# Altium project MultiSheetPractice.PrjPcb
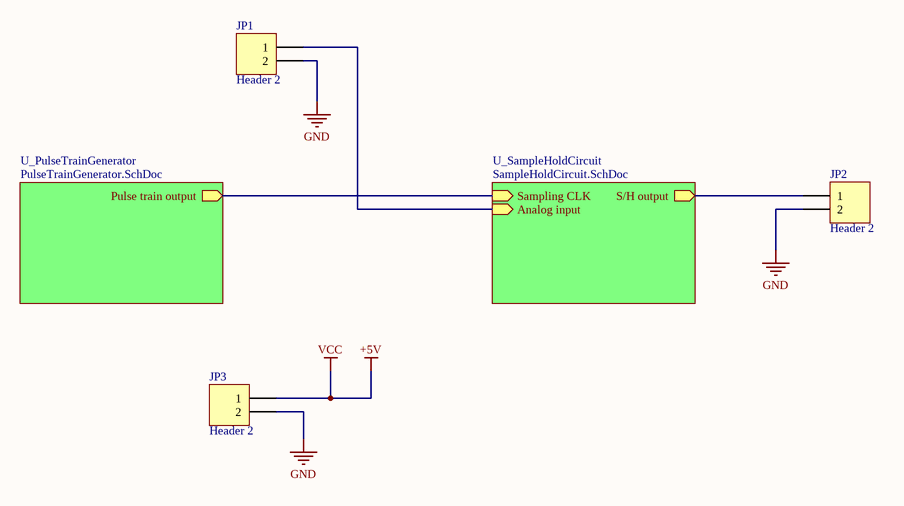
[diagram p0: Top.SchDoc]
3 sheets, 13 parts. Net scope: hierarchical (ports join the sheet entries above them; power ports are global).
Sheets:
  Top.SchDoc
    U_SampleHoldCircuit = SampleHoldCircuit.SchDoc
    U_PulseTrainGenerator = PulseTrainGenerator.SchDoc

## Sheet Top.SchDoc
size A4; SheetNumber: 1; SheetTotal: 3

### Parts
JP1  Header 2  [HDR1X2]
JP2  Header 2  [HDR1X2]
JP3  Header 2  [HDR1X2]

### Sub-sheets
U_PulseTrainGenerator = PulseTrainGenerator.SchDoc: Pulse train output (out)
U_SampleHoldCircuit = SampleHoldCircuit.SchDoc: Sampling CLK (in), Analog input (in), S/H output (out)

### Nets
+5V: JP3.1  [also labelled VCC]
GND: JP1.2 JP2.2 JP3.2
NetJP1_1: JP1.1 ; sheet U_SampleHoldCircuit/Analog input
NetJP2_1: JP2.1 ; sheet U_SampleHoldCircuit/S/H output
NetU2_2: sheet U_SampleHoldCircuit/Sampling CLK, sheet U_PulseTrainGenerator/Pulse train output

### Library data of the parts
JP1-JP3 = Header 2: Header, 2-Pin; Revision: 17-Jul-2002: Re-released for DXP Platform.; Publisher: Altium Limited

## Sheet SampleHoldCircuit.SchDoc
size A4; SheetNumber: 3; SheetTotal: 3
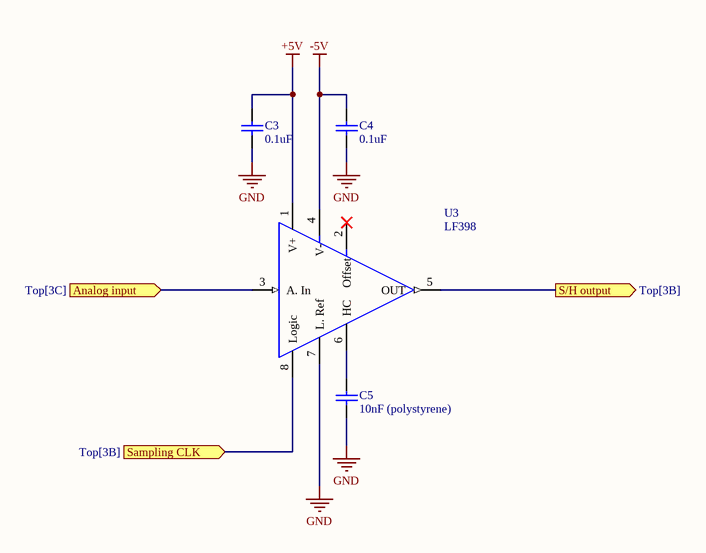
[diagram p1: SampleHoldCircuit.SchDoc]

### Parts
C3  0.1uF
C4  0.1uF
C5  10nF (polystyrene)
U3  LF398

### Ports
Analog input (in, see Top[3C]), S/H output (out, see Top[3B]), Sampling CLK (in, see Top[3B])

### Nets
+5V: C3.2 U3.1(V+)
-5V: C4.2 U3.4(V-)
GND: C3.1 C4.1 C5.1 U3.7(L._Ref)
NetC5_2: C5.2 U3.6(HC)
NetJP1_1: U3.3(A._In) ; port Analog input
NetJP2_1: U3.5(OUT) ; port S/H output
NetU2_2: U3.8(Logic) ; port Sampling CLK

Not connected (* = marked no-connect by the designer): U3 2(Offset)*

### Library data of the parts
C3-C5 = Cap: Ceramic Capacitor; Value: 100pF; Published: 8-Jun-2000; LatestRevisionDate: 17-Jul-2002; LatestRevisionNote: Re-released for DXP Platform.; PackageReference: RAD-0.3; Publisher: Altium Limited; PackageDescription: Radial Cap, Thru-Hole; 2 Leads; 0.3 in Pin Spacing
U3 = LF398: Sample and Hold

## Sheet PulseTrainGenerator.SchDoc
size A4; SheetNumber: 2; SheetTotal: 3
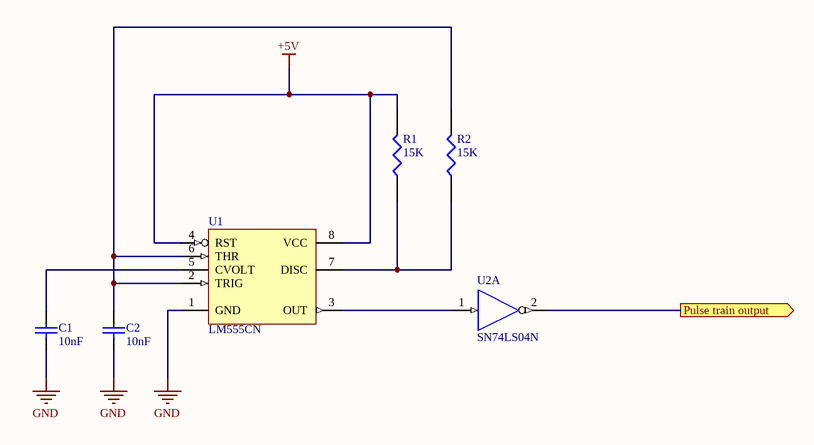
[diagram p2: PulseTrainGenerator.SchDoc]

### Parts
C1  10nF
C2  10nF
R1  15K  [axial0.5]
R2  15K  [axial0.5]
U1  LM555CN  [DIP-8]
U2  SN74LS04N  [DIP14]  (part A of 6)

### Ports
Pulse train output (out, see Top[2C])

### Nets
+5V: R1.2 U1.4(RST) U1.8(VCC) U2.14(VCC)  [also labelled VCC]
GND: C1.1 C2.1 U1.1(GND) U2.7(GND)
NetC1_2: C1.2 U1.5(CVOLT)
NetC2_2: C2.2 R2.2 U1.2(TRIG) U1.6(THR)
NetR1_1: R1.1 R2.1 U1.7(DISC)
NetU1_3: U1.3(OUT) U2.1(A)
NetU2_2: U2.2(Y) ; port Pulse train output

### Library data of the parts
C1 C2 = Cap: Ceramic Capacitor; Value: 100pF; Published: 8-Jun-2000; LatestRevisionDate: 17-Jul-2002; LatestRevisionNote: Re-released for DXP Platform.; PackageReference: RAD-0.3; Publisher: Altium Limited; PackageDescription: Radial Cap, Thru-Hole; 2 Leads; 0.3 in Pin Spacing
R1 R2 = RES1: Resistor
U1 = LM555CN: Timer; Package Information: Latest Revision: Sep-1997; Published: 15-Apr-2002; Datasheet: Latest Revision: May-1997; Package Reference: N08E; Publisher: Altium Limited
U2 = SN74LS04N: Hex Inverter; Published: 8-Jun-2000; LatestRevisionDate: 04-Mar-2005; LatestRevisionNote: Stylized 3D Model Added.; DatasheetVersion: Mar-1988; PackageVersion: Oct-1995; PackageReference: N014; Publisher: Altium Limited; PackageDescription: DIP; 14 Leads; Row Spacing 7.62 mm; Pitch 2.54 mm; ComponentLink1Description: Manufacturer Link; ComponentLink1URL: http://www.ti.com/; ComponentLink2Description: Datasheet; ComponentLink2URL: http://www-s.ti.com/sc/ds/sn5404.pdf; ComponentLink3Description: Packaging Specification; ComponentLink3URL: http://focus.ti.com/lit/ml/mpdi002c/mpdi002c.pdf

## Nets that join several sheets
+5V: Top (JP3.1), SampleHoldCircuit (C3.2 U3.1), PulseTrainGenerator (R1.2 U1.4 U1.8 U2.14)
GND: Top (JP1.2 JP2.2 JP3.2), SampleHoldCircuit (C3.1 C4.1 C5.1 U3.7), PulseTrainGenerator (C1.1 C2.1 U1.1 U2.7)
NetJP1_1: Top (JP1.1), SampleHoldCircuit (U3.3)
NetJP2_1: Top (JP2.1), SampleHoldCircuit (U3.5)
NetU2_2: SampleHoldCircuit (U3.8), PulseTrainGenerator (U2.2)